# EAGLE design untitled (EAGLE 9.6.2)
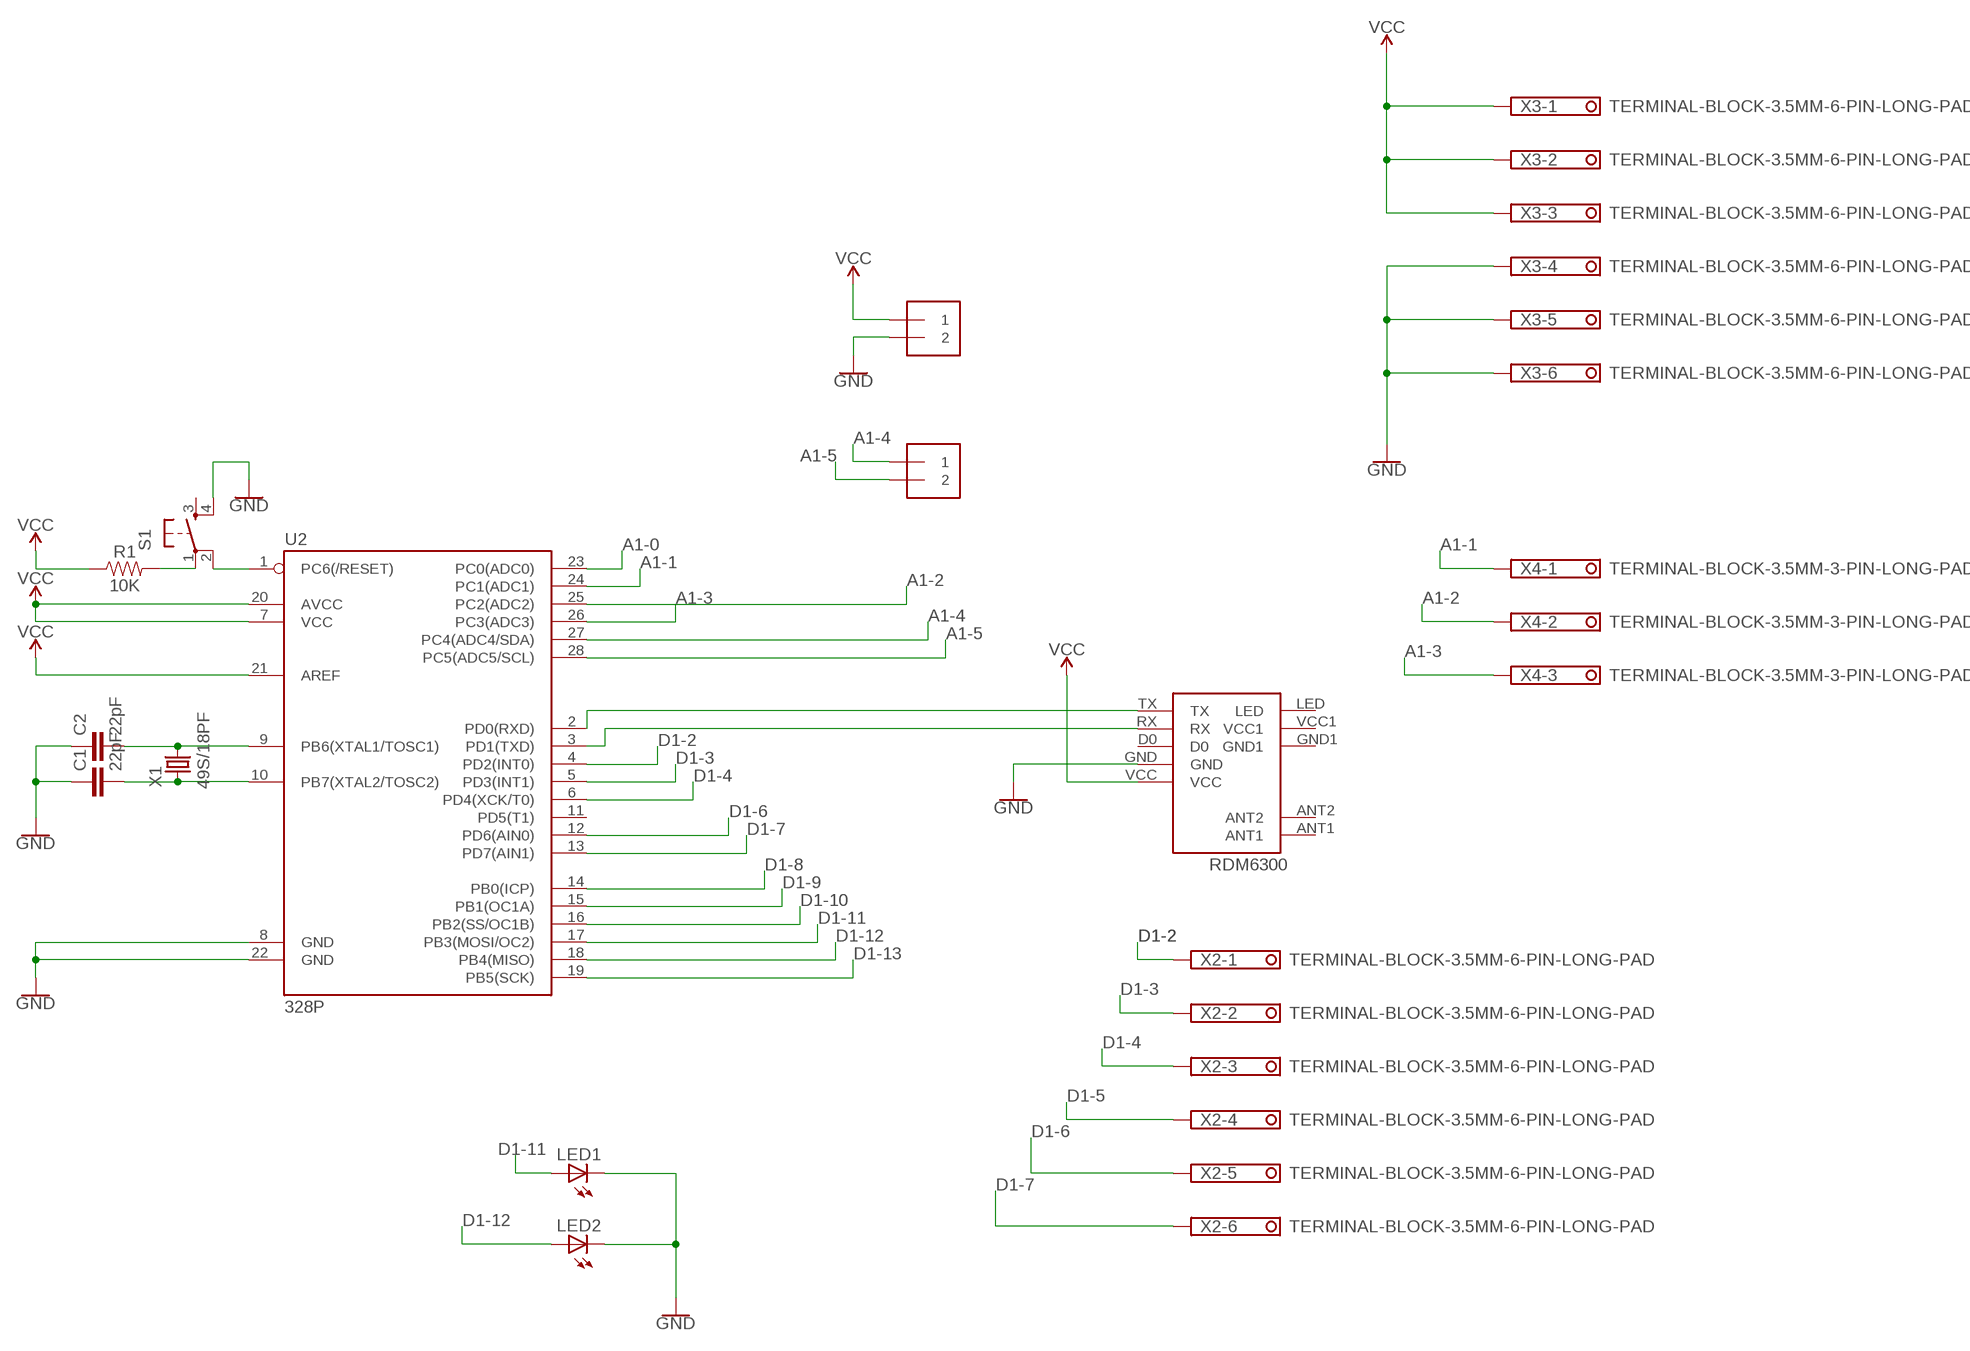
[diagram p0: schematic, sheet 1]

## Parts
C1  22pF  22PF-PTH-2.54MM-200V-5%  [CAP-PTH-2.54]
C2  22pF  22PF-PTH-2.54MM-200V-5%  [CAP-PTH-2.54]
J1  1X2-3.5MM  [1X2-3.5MM]
J2  1X2-3.5MM  [1X2-3.5MM]
LED1  LED5MM  [LED5MM]
LED2  LED5MM  [LED5MM]
R1  10K  10MOHM-HORIZ-1/4W-5%  [AXIAL-0.3]
RDM1  RDM6300  [RDM6300]
S1  TAC_SWITCHPTH  [TACTILE-PTH]
U2  328P  ATMEGA328P_PDIP  [DIP28]
X1  49S/18PF  [XTAL_HC49]
X2  TERMINAL-BLOCK-3.5MM-6-PIN-LONG-PAD  [TERMINAL-BLOCK-6-PIN-3.5MM-LONG-PAD]
X3  TERMINAL-BLOCK-3.5MM-6-PIN-LONG-PAD  [TERMINAL-BLOCK-6-PIN-3.5MM-LONG-PAD]
X4  TERMINAL-BLOCK-3.5MM-3-PIN-LONG-PAD  [TERMINAL-BLOCK-3-PIN-3.5MM-LONG-PAD]

## Nets
A1-0: U2.23(PC0(ADC0))
A1-1: U2.24(PC1(ADC1)) X4.1
A1-2: U2.25(PC2(ADC2)) X4.2
A1-3: U2.26(PC3(ADC3)) X4.3
A1-4: J2.1 U2.27(PC4(ADC4/SDA))
A1-5: J2.2 U2.28(PC5(ADC5/SCL))
D1-2: U2.4(PD2(INT0)) X2.1
D1-3: U2.5(PD3(INT1)) X2.2
D1-4: U2.6(PD4(XCK/T0)) X2.3
D1-5: X2.4
D1-6: U2.12(PD6(AIN0)) X2.5
D1-7: U2.13(PD7(AIN1)) X2.6
D1-8: U2.14(PB0(ICP))
D1-9: U2.15(PB1(OC1A))
D1-10: U2.16(PB2(SS/OC1B))
D1-11: LED1.A U2.17(PB3(MOSI/OC2))
D1-12: LED2.A U2.18(PB4(MISO))
D1-13: U2.19(PB5(SCK))
GND: C1.1 C2.1 J1.2 LED1.K(C) LED2.K(C) RDM1.GND S1.4 U2.8(GND) U2.22(GND) X3.4 X3.5 X3.6
N$1: C2.2 U2.9(PB6(XTAL1/TOSC1)) X1.2
N$2: C1.2 U2.10(PB7(XTAL2/TOSC2)) X1.1
N$3: R1.P$2 S1.1
N$4: S1.2 U2.1(PC6(/RESET))
N$5: RDM1.TX U2.2(PD0(RXD))
N$6: RDM1.RX U2.3(PD1(TXD))
VCC: J1.1 R1.P$1 RDM1.VCC U2.7(VCC) U2.20(AVCC) U2.21(AREF) X3.1 X3.2 X3.3
Unconnected: RDM1.ANT1 RDM1.ANT2 RDM1.D0 RDM1.GND1 RDM1.LED RDM1.VCC1 S1.3 U2.11(PD5(T1))

## Library data of the parts
C1 C2 = SparkFun-Capacitors:22PF: 22pF ceramic capacitors A capacitor is a passive two-terminal electrical component used to store electrical energy temporarily in an electric field.; PROD_ID: CAP-09128
J1 J2 = adafruit:1X2: 3.5mm Terminal block http://www.ladyada.net/library/pcb/eaglelibrary.html
LED1 LED2 = adafruit:LED: LED OSRAM: - CHIPLED LG R971, LG N971, LY N971, LG Q971, LY Q971, LO R971, LY R971 LH N974, LH R974 LS Q976, LO Q976, LY Q976 LO Q996 - Hyper CHIPLED LW Q18S LB Q993, LB Q99A, LB R99A - SideLED LS A670, LO A670, LY A670, LG A670, LP A670 LB A673, LV A673, LT A673, LW A673 LH A674 LY A675 LS A676, LA A676, LO A676, LY A676, LW A676 LS A679, LY A679, LG A679 - Hyper Micro SIDELED® LS Y876, LA Y876, LO Y876, LY Y876 LT Y87S - SmartLED LW L88C, LW L88S LB L89C, LB L89S, LG L890 LS L89K, LO L89K, LY L89K LS L896, LA L896, LO L896, LY L896 - TOPLED LS T670, LO T670, LY T670, LG T670, LP T670 LSG T670, LSP T670, LSY T670, LOP T670, LYG T670 LG T671, LOG T671, LSG T671 LB T673, LV T673, LT T673, LW T673 LH T674 LS T676, LA T676, LO T676, LY T676, LB T676, LH T676, LSB T676, LW T676 LB T67C, LV T67C, LT T67C, LS T67K, LO T67K, LY T67K, LW E67C LS E67B, LA E67B, LO E67B, LY E67B, LB E67C, LV E67C, LT E67C LW T67C LS T679, LY T679, LG T679 LS T770, LO T770, LY T770, LG T770, LP T770 LB T773, LV T773, LT T773, LW T773 LH T774 LS E675, LA E675, LY E675, LS T675 LS T776, LA T776, LO T776, LY T776, LB T776 LHGB T686 LT T68C, LB T68C - Hyper Mini TOPLED® LB M676 - Mini TOPLED Santana® LG M470 LS M47K, LO M47K, LY M47K Source: http://www.osram.convergy.de/
R1 = SparkFun-Resistors:10MOHM: RES-09327; PROD_ID: RES-09327; VALUE: 10M
RDM1 = rdm6300:RDM6300: 125kHz RFID Reader Module
S1 = SparkFun:TAC_SWITCH: Momentary Switch Button commonly used for reset or general input. Spark Fun Electronics SKU : COM-00097
U2 = SparkFun-IC-Microcontroller:ATMEGA328P_PDIP: Atmel 328P Through hole ATMEGA328P uC used in the Arduino 32kb flash, 1k EEPROM, 2k SRAM Datasheet <http://www.sparkfun.com/datasheets/Components/SMD/ATMega328.pdf> SparkFun Products Storefront component: AVR 28 Pin 20MHz 32K 6A/D - ATMega328P <https://www.sparkfun.com/products/9061> (COM-09061) SparkFun Simon Says - Through-Hole Soldering Kit <https://www.sparkfun.com/products/10547> (KIT-10547) SparkFun Learn to Solder - Simon Says <https://www.sparkfun.com/products/13708> (KIT-13708) SparkFun BigTime Watch Kit <https://www.sparkfun.com/products/11734> (KIT-11734) SparkFun ClockIt <https://www.sparkfun.com/products/10930> (KIT-10930) SparkFun Serial Enabled LCD Kit <https://www.sparkfun.com/products/10097> (LCD-10097) SparkFun Simon Tilts - Through Hole Soldering Kit <https://www.sparkfun.com/products/12634> (KIT-12634) SparkFun Frequency Counter Kit <https://www.sparkfun.com/products/10140> (KIT-10140) FabFM Radio Kit <https://www.sparkfun.com/products/11043> (KIT-11043) SparkFun Binary Blaster Kit <https://www.sparkfun.com/products/12037> (KIT-12037) SparkFun Metro-Gnome <https://www.sparkfun.com/products/9236> (KIT-09236) ATmega328 with Arduino Optiboot (Uno) <https://www.sparkfun.com/products/10524> (DEV-10524); PROD_ID: IC-09136
X1 = Crystals_Oscillators:49S/18PF: Crystal Manufacturer's datasheet <https://datasheet.octopart.com/49S-18PF-Xinhunjing-datasheet-30677139.pdf>; CREATED_BY: PCBLayout.com; MANUFACTURER: Xinhunjing; MPN: 49S/18PF; PACKAGE: SMD
X2 X3 = Rembrandt Electronics - Terminal Block 3-5mm v1-0:TERMINAL-BLOCK-3.5MM-6-PIN: Terminal Block 3.5mm Pitch: 3,5 mm Number of pins: 6 Created by Rembrandt Electronics www.rembrandtelectronics.com
X4 = Rembrandt Electronics - Terminal Block 3-5mm v1-0:TERMINAL-BLOCK-3.5MM-3-PIN: Terminal Block 3.5mm Pitch: 3,5 mm Number of pins: 3 Created by Rembrandt Electronics www.rembrandtelectronics.com

## Board
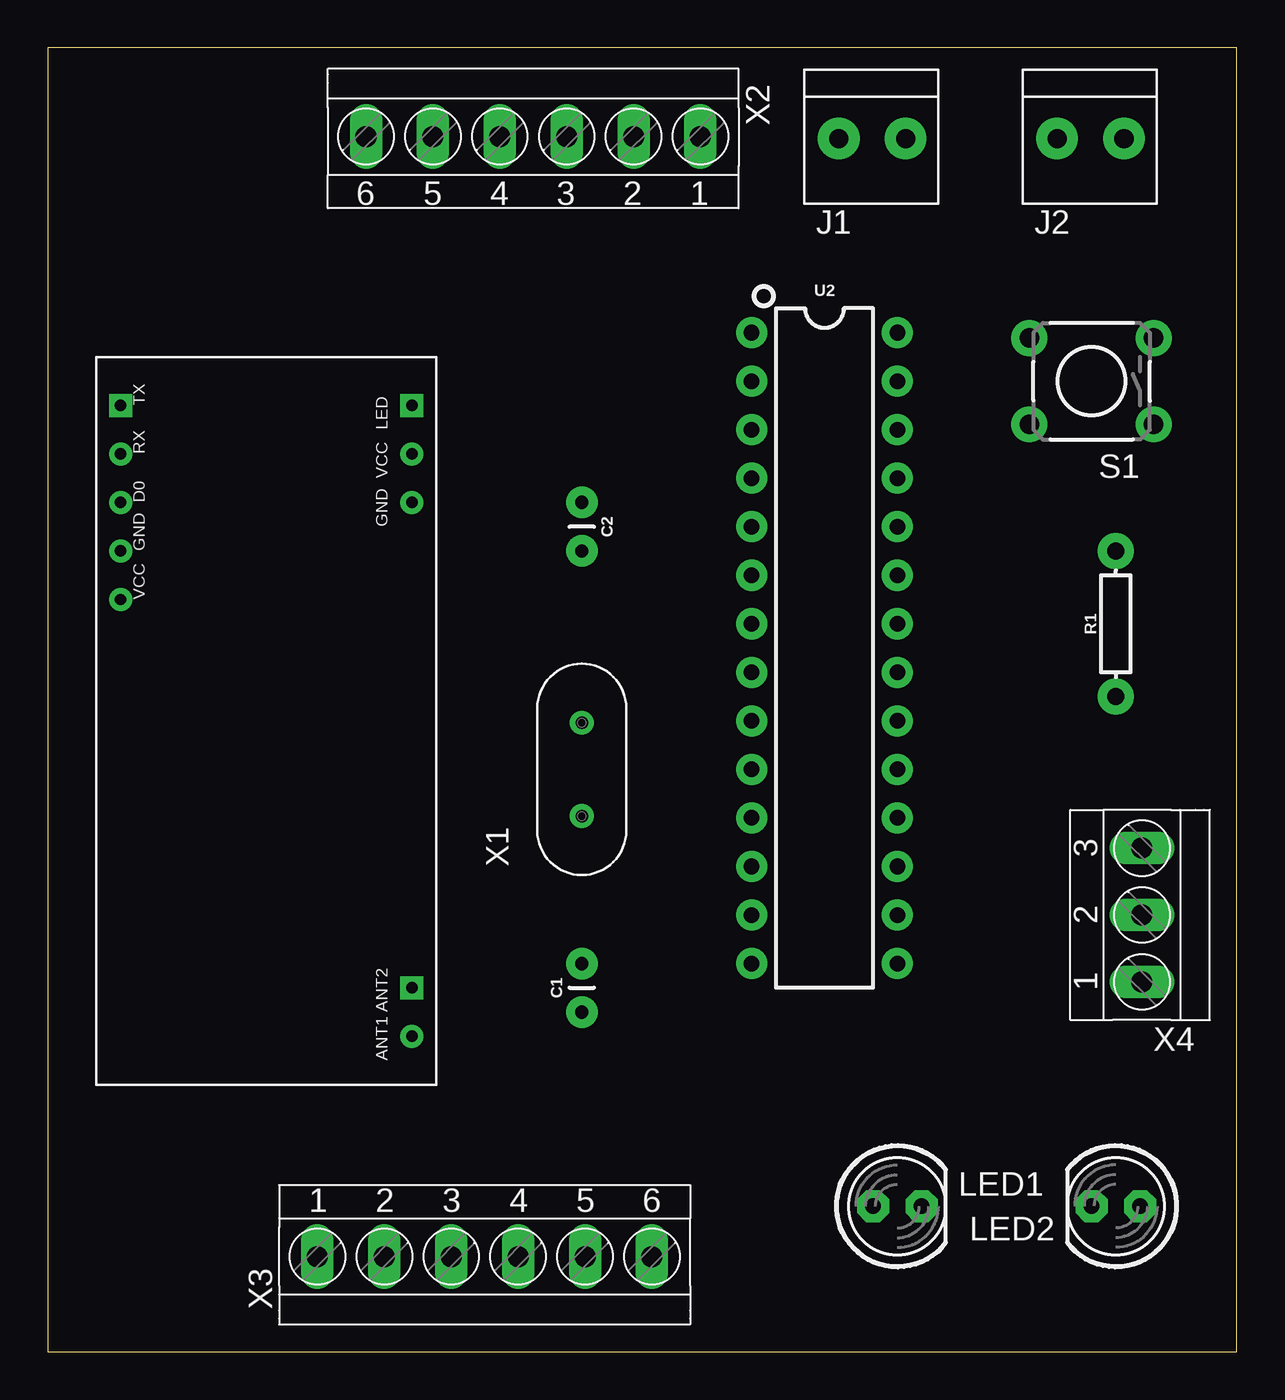
[diagram p1: board, top side]
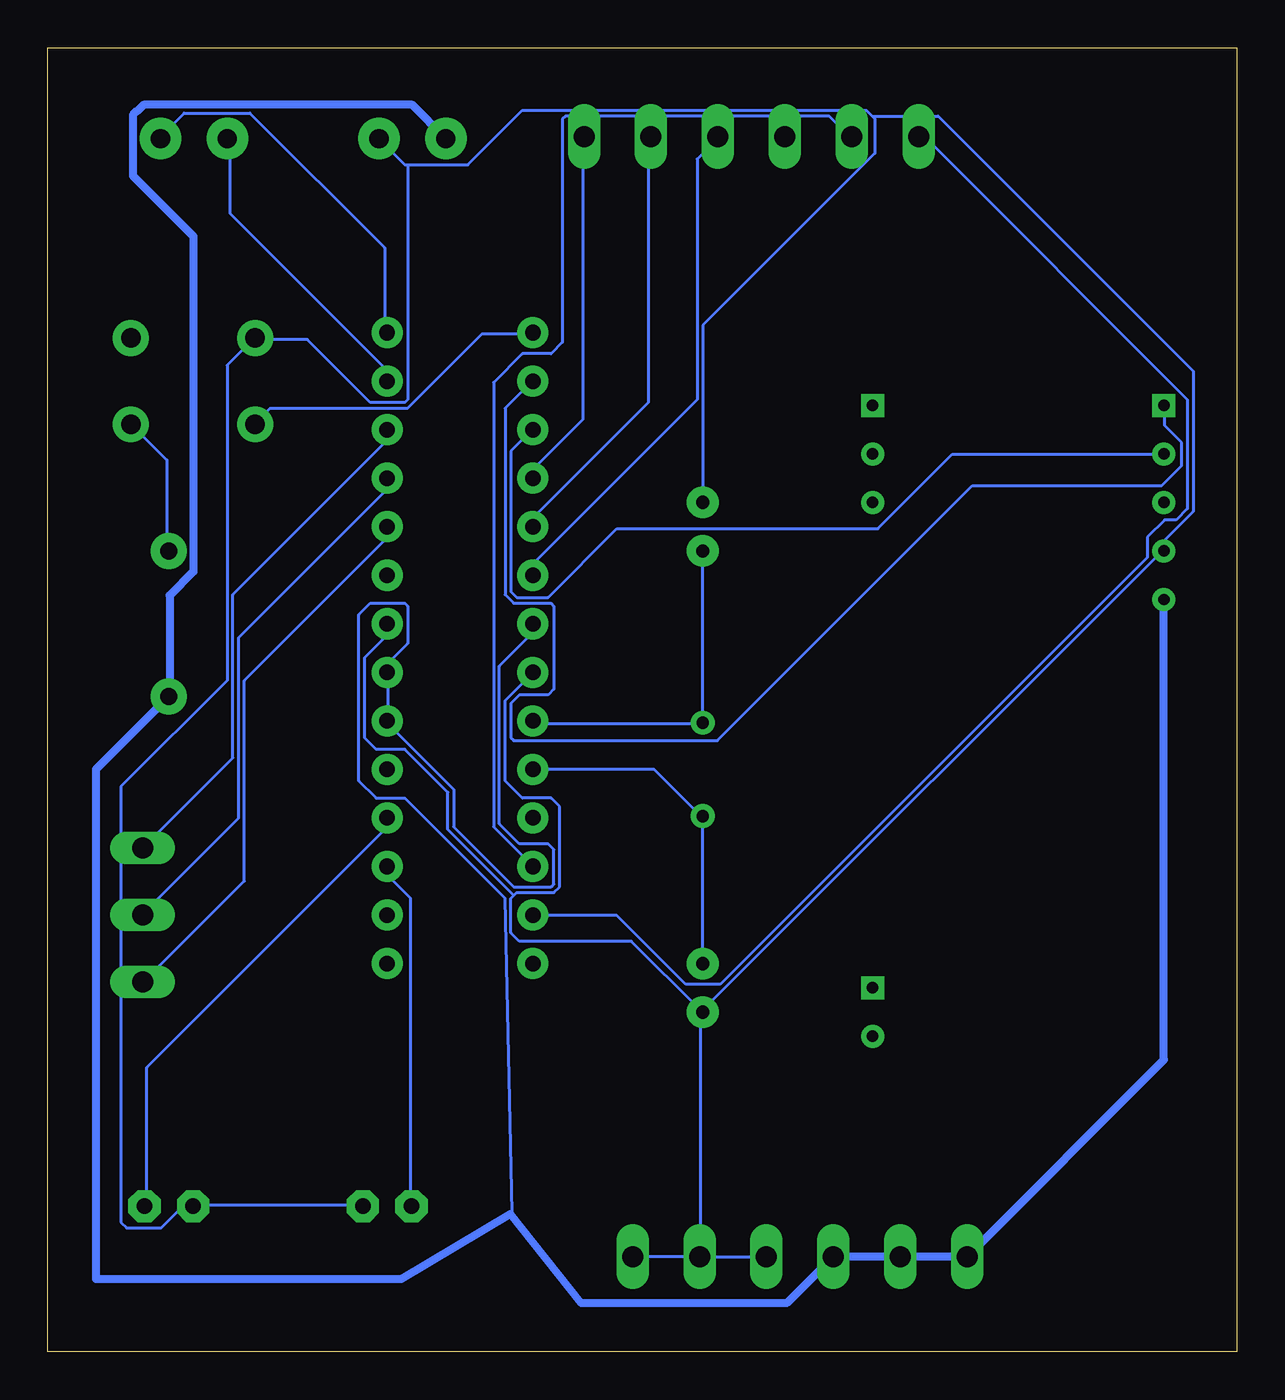
[diagram p2: board, bottom side, seen from below]

Size 62.21 x 68.25 mm. Coordinates in mm from the lower left corner, seen from the top.
Outline: 0,0 62.21,0 62.21,68.25 0,68.25 0,0
Copper layers 16: Bottom 0.035mm
Design rules "eC_1Layer_PClass6_BaseCopperO35_eCDefault *": minimum track width 0.15mm, minimum drill 0.35mm, track to track 0.15mm, track to pad 0.15mm, pad to pad 0.15mm, via to via 0.15mm, smd to smd 0mil, copper to edge 0.25mm, drill to drill 0.35mm, minimum pad ring 0.3mm, minimum via ring 0.3mm, stop-mask expansion 0mil, vias tented up to drill 0.45mm, thermal gap 0.2mm

### Footprints (pad centres in the part's own frame; a part is rotated, then mirrored left to right if it is on the bottom)
CAP-PTH-2.54 = drill 0.7 pad 1.651: 1 -1.27,0; 2 1.27,0
1X2-3.5MM = drill 1 pad 2.184: 1 1.8,0; 2 -1.7,0
LED5MM = drill 0.813 pad 1.676 octagon: A -1.27,0; K 1.27,0
AXIAL-0.3 = drill 0.9 pad 1.88: P$1 -3.81,0; P$2 3.81,0
RDM6300 = drill 0.6: ANT1 -16.51,-7.62; D0 11.43,7.62; GND 8.89,7.62; GND1 11.43,-7.62; RX 13.97,7.62; VCC 6.35,7.62; VCC1 13.97,-7.62 | drill 0.6 square: ANT2 -13.97,-7.62; LED 16.51,-7.62; TX 16.51,7.62
TACTILE-PTH = drill 1.016 pad 1.88: 1 -3.251,2.261; 2 3.251,2.261; 3 -3.251,-2.261; 4 3.251,-2.261
DIP28 = drill 0.813 pad 1.626: 1 -16.51,-3.81; 2 -13.97,-3.81; 3 -11.43,-3.81; 4 -8.89,-3.81; 5 -6.35,-3.81; 6 -3.81,-3.81; 7 -1.27,-3.81; 8 1.27,-3.81; 9 3.81,-3.81; 10 6.35,-3.81; 11 8.89,-3.81; 12 11.43,-3.81; 13 13.97,-3.81; 14 16.51,-3.81; 15 16.51,3.81; 16 13.97,3.81; 17 11.43,3.81; 18 8.89,3.81; 19 6.35,3.81; 20 3.81,3.81; 21 1.27,3.81; 22 -1.27,3.81; 23 -3.81,3.81; 24 -6.35,3.81; 25 -8.89,3.81; 26 -11.43,3.81; 27 -13.97,3.81; 28 -16.51,3.81
XTAL_HC49 = drill 0.65 pad 1.05: 1 -2.44,0; 2 2.44,0
TERMINAL-BLOCK-6-PIN-3.5MM-LONG-PAD = drill 1.1 pad 1.7 long: 1 -8.75,-0.1; 2 -5.25,-0.1; 3 -1.75,-0.1; 4 1.75,-0.1; 5 5.25,-0.1; 6 8.75,-0.1
TERMINAL-BLOCK-3-PIN-3.5MM-LONG-PAD = drill 1.1 pad 1.7 long: 1 -3.5,-0.1; 2 0,-0.1; 3 3.5,-0.1

### Placement (x,y rotation side)
C1  27.94,19.05 90 top
C2  27.94,43.18 270 top
J1  43.18,63.5 180 top
J2  54.61,63.5 180 top
LED1  44.45,7.62 0 top
LED2  55.88,7.62 180 top
R1  55.88,38.1 90 top
RDM1  11.43,33.02 90 top
S1  54.61,50.8 180 top
U2  40.64,36.83 270 top
X1  27.94,30.48 90 top
X2  25.4,63.5 180 top
X3  22.86,5.08 0 top
X4  57.15,22.86 90 top

### Tracks (layer width: path | path; a pad name or v marks a point on that pad's centre or on a via)
A1-1
  Bottom 0.15: U2.24 44.58,43.08 44.58,42.48 51.93,35.13 51.93,24.63 57.18,19.38 X4.1
A1-2
  Bottom 0.15: U2.25 44.58,45.63 44.58,45.03 52.23,37.38 52.23,27.93 57.18,22.98 X4.2
A1-3
  Bottom 0.15: X4.3 52.53,31.08 52.53,39.63 44.58,47.58 44.58,48.18 U2.26
A1-4
  Bottom 0.15: U2.27 44.58,50.88 44.58,51.48 52.68,59.58 52.68,63.48 J2.1
A1-5
  Bottom 0.15: U2.28 44.58,53.43 44.58,57.78 51.63,64.83 55.08,64.83 56.28,63.63 J2.2
D1-2
  Bottom 0.15: U2.4 36.78,45.78 36.78,46.23 34.23,48.78 34.23,63.48 X2.1
D1-3
  Bottom 0.15: U2.5 36.78,43.23 36.78,43.68 30.78,49.68 30.78,63.48 X2.2
D1-4
  Bottom 0.15: U2.6 36.78,40.68 36.78,41.28 28.23,49.83 28.23,62.43 27.18,63.48 X2.3
D1-6
  Bottom 0.15: U2.12 36.93,25.53 38.88,27.48 38.88,50.73 37.38,52.23 35.88,52.23 35.28,52.83 35.28,64.53 35.13,64.68 21.33,64.68 20.28,63.63 X2.5
D1-7
  Bottom 0.15: U2.13 36.78,22.83 32.43,22.83 28.83,19.23 27.03,19.23 4.68,41.58 4.68,42.63 3.78,43.53 3.18,43.53 2.58,44.13 2.58,49.83 16.23,63.48 16.53,63.48 X2.6
D1-11
  Bottom 0.15: U2.17 44.43,25.38 44.43,24.93 43.23,23.73 43.23,7.68 LED1.A
D1-12
  Bottom 0.15: U2.18 44.58,27.93 44.58,27.33 57.03,14.88 57.03,7.68 LED2.A
GND
  Bottom 0.15: 28.08,4.98 X3.4 | X3.6 X3.5 28.08,4.98 | C1.1 27.93,17.88 3.93,41.88 RDM1.GND 3.78,42.03 3.78,42.48 2.28,43.98 2.28,51.33 15.63,64.68 19.08,64.68 | 37.83,23.88 37.98,23.73 37.98,21.93 37.53,21.48 31.68,21.48 28.08,17.88 C1.1 | 37.83,23.88 37.68,24.03 35.73,24.03 35.43,24.33 35.43,28.53 35.88,28.98 37.38,28.98 38.28,29.88 38.28,34.08 36.93,35.43 U2.8 | 37.83,23.88 41.28,27.33 41.28,29.28 43.53,31.53 45.03,31.53 45.63,32.13 45.63,36.33 44.58,37.38 44.58,37.98 U2.22 | 28.08,4.98 28.08,17.73 C1.1 | LED1.K 45.78,7.68 54.48,7.68 LED2.K 54.63,7.53 55.23,7.53 56.28,6.48 58.08,6.48 58.38,6.78 58.38,29.58 52.83,35.13 52.83,51.63 51.48,52.98 S1.4 51.33,52.98 48.63,52.98 45.33,49.68 43.53,49.68 43.38,49.83 43.38,62.13 | 19.08,64.68 19.38,64.98 37.38,64.98 40.23,62.13 43.38,62.13 | 19.08,64.68 18.93,64.53 18.93,62.73 27.93,53.73 27.93,44.58 C2.1 | 43.38,62.13 43.53,62.13 44.88,63.48 J1.2
N$1
  Bottom 0.15: U2.9 36.78,32.88 28.08,32.88 X1.2 27.93,33.03 27.93,41.88 C2.2
N$2
  Bottom 0.15: C1.2 27.93,20.43 27.93,27.93 X1.1 28.08,28.08 30.48,30.48 U2.10
N$3
  Bottom 0.15: R1.P$2 55.98,42.03 55.98,46.68 57.78,48.48 S1.1
N$4
  Bottom 0.15: U2.1 36.93,53.28 39.48,53.28 43.38,49.38 50.58,49.38 51.33,48.63 S1.2
N$5
  Bottom 0.15: RDM1.TX 3.78,49.53 3.78,48.48 2.88,47.58 2.88,46.38 3.93,45.33 13.83,45.33 27.18,31.98 37.83,31.98 37.98,32.13 37.98,33.93 37.53,34.38 36.03,34.38 35.73,34.68 35.73,39.03 35.88,39.18 37.83,39.18 38.28,39.63 38.28,49.38 36.93,50.73 U2.2
N$6
  Bottom 0.15: RDM1.RX 3.93,46.98 14.88,46.98 18.78,43.08 32.43,43.08 36.03,39.48 37.68,39.48 37.98,39.78 37.98,47.13 36.93,48.18 U2.3
VCC
  Bottom 0.15: U2.7 36.93,37.98 36.93,37.53 38.58,35.88 38.58,27.63 37.53,26.58 36.03,26.58 35.73,26.28 35.73,24.48 35.88,24.33 37.83,24.33 40.98,27.48 40.98,29.43 44.43,32.88 U2.20 44.43,33.03 44.43,35.43 U2.21 44.43,35.58 44.43,36.03 43.38,37.08 43.38,39.03 43.53,39.18 45.33,39.18 45.93,38.58 45.93,29.88 45.03,28.98 43.53,28.98 38.28,23.73 37.92,7.26 | X3.1 X3.2 17.78,4.98 X3.3 21.18,4.98 | 21.34,4.82 22.38,3.78 | 55.98,34.23 R1.P$1
  Bottom 0.406: 17.78,4.98 X3.1 3.81,15.28 RDM1.VCC | X3.2 21.18,4.98 21.34,4.82 | J1.1 43.14,65.26 57.2,65.26 57.52,64.94 57.55,64.94 57.76,64.74 57.76,61.55 54.59,58.38 54.59,40.82 55.83,39.58 55.83,34.34 R1.P$1 59.69,30.48 59.69,3.81 43.72,3.81 38,7.21 34.29,2.54 23.55,2.54 X3.3